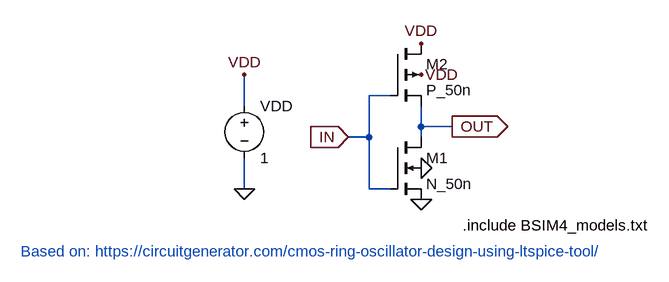
[diagram p0: schematic CMOS.asc]
CMOS.asc, the LTspice schematic file:
Version 4
SHEET 1 880 680
WIRE 48 208 16 208
WIRE -176 224 -176 176
WIRE 96 256 96 224
WIRE 144 256 96 256
WIRE 16 272 16 208
WIRE 16 272 -16 272
WIRE 96 272 96 256
WIRE -176 352 -176 304
WIRE 16 352 16 272
WIRE 48 352 16 352
FLAG -176 176 VDD
FLAG 96 128 VDD
FLAG 96 176 VDD
FLAG -176 352 0
FLAG 96 368 0
FLAG 96 320 0
FLAG -16 272 IN
IOPIN -16 272 In
FLAG 144 256 OUT
IOPIN 144 256 Out
SYMBOL pmos4 48 128 R0
SYMATTR InstName M2
SYMATTR Value P_50n
SYMATTR Value2 l=50n w=1u
SYMBOL nmos4 48 272 R0
SYMATTR InstName M1
SYMATTR Value N_50n
SYMATTR Value2 l=50n w=500n
SYMBOL voltage -176 208 R0
WINDOW 123 0 0 Left 0
WINDOW 39 0 0 Left 0
SYMATTR InstName VDD
SYMATTR Value 1
TEXT 160 408 Left 2 !.include BSIM4_models.txt
TEXT -520 448 Left 2 ;Based on: https://circuitgenerator.com/cmos-ring-oscillator-design-using-ltspice-tool/

The netlist it stands for:
* CMOS.asc
M2 VDD IN OUT VDD P_50n l=50n w=1u
M1 OUT IN 0 0 N_50n l=50n w=500n
VDD VDD 0 1
.model NMOS NMOS
.model PMOS PMOS
.lib standard.mos
.include BSIM4_models.txt
* Based on: https://circuitgenerator.com/cmos-ring-oscillator-design-using-ltspice-tool/
.backanno
.end